# Altium schematic sheet ARM+SERVO+I O.SchDoc
size A
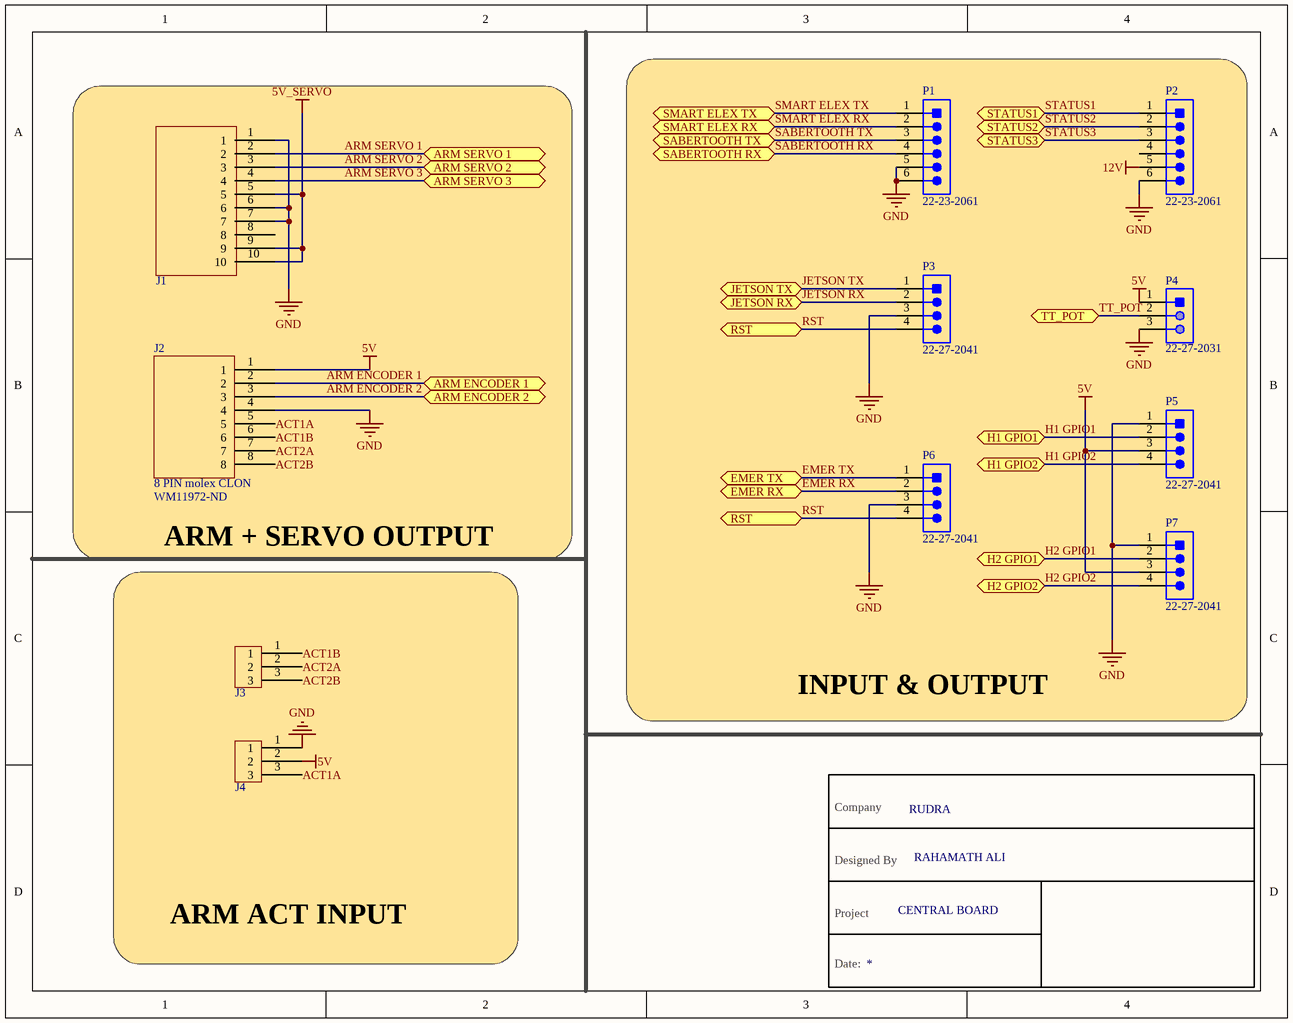
[diagram p0: ARM+SERVO+I O.SchDoc]

## Parts
?  Project: CENTRAL BOARD  Designed By: RAHAMATH ALI  Company: RUDRA  (hidden comment: Schematic Table)  (graphical)
J1  10 PIN MOLEX CLON  [10 pin molex]  (value not drawn)
J2  8 PIN molex CLON  Supplier Part Number 1: WM11972-ND  [8 PIN MOLEX CLON]
J3  3 PIN GREEN  [PHOENIX_MSTBA_2,5_3-G-5,08_1757255]  (value not drawn)
J4  3 PIN GREEN  [PHOENIX_MSTBA_2,5_3-G-5,08_1757255]  (value not drawn)
P1  22-23-2061  [MOLX-22-23-2061_V]
P2  22-23-2061  [MOLX-22-23-2061_V]
P3  22-27-2041  [MOLX-22-27-2041_V]
P4  22-27-2031  [MOLX-22-27-2031_V]
P5  22-27-2041  [MOLX-22-27-2041_V]
P6  22-27-2041  [MOLX-22-27-2041_V]
P7  22-27-2041  [MOLX-22-27-2041_V]

## Blocks framed on the sheet
INPUT & OUTPUT: P1-P7
ARM + SERVO OUTPUT: J1 J2
ARM ACT INPUT: J3 J4

## Ports
ARM ENCODER 1 (bidir), ARM ENCODER 2 (bidir), ARM SERVO 1 (bidir), ARM SERVO 2 (bidir), ARM SERVO 3 (bidir), EMER RX (bidir), EMER TX (bidir), H1 GPIO1 (bidir), H1 GPIO2 (bidir), H2 GPIO1 (bidir), H2 GPIO2 (bidir), JETSON RX (bidir), JETSON TX (bidir), RST (bidir), SABERTOOTH RX (bidir), SABERTOOTH TX (bidir), SMART ELEX RX (bidir), SMART ELEX TX (bidir), STATUS1 (bidir), STATUS2 (bidir), STATUS3 (bidir), TT_POT (bidir)

## Nets
5V: J2.1 J4.2 P4.1 P5.3 P7.3
5V_SERVO: J1.5 J1.9 J1.10
12V: P2.5
GND: J1.1 J1.6 J1.7 J2.4 J4.1 P1.5 P1.6 P2.6 P3.3 P4.3 P5.1 P6.3 P7.1
ACT1A: J2.5 J4.3
ACT1B: J2.6 J3.1
ACT2A: J2.7 J3.2
ACT2B: J2.8 J3.3
ARM ENCODER 1: J2.2 ; port ARM ENCODER 1
ARM ENCODER 2: J2.3 ; port ARM ENCODER 2
ARM SERVO 1: J1.2 ; port ARM SERVO 1
ARM SERVO 2: J1.3 ; port ARM SERVO 2
ARM SERVO 3: J1.4 ; port ARM SERVO 3
EMER RX: P6.2 ; port EMER RX
EMER TX: P6.1 ; port EMER TX
H1 GPIO1: P5.2 ; port H1 GPIO1
H1 GPIO2: P5.4 ; port H1 GPIO2
H2 GPIO1: P7.2 ; port H2 GPIO1
H2 GPIO2: P7.4 ; port H2 GPIO2
JETSON RX: P3.2 ; port JETSON RX
JETSON TX: P3.1 ; port JETSON TX
RST: P3.4 P6.4 ; port RST
SABERTOOTH RX: P1.4 ; port SABERTOOTH RX
SABERTOOTH TX: P1.3 ; port SABERTOOTH TX
SMART ELEX RX: P1.2 ; port SMART ELEX RX
SMART ELEX TX: P1.1 ; port SMART ELEX TX
STATUS1: P2.1 ; port STATUS1
STATUS2: P2.2 ; port STATUS2
STATUS3: P2.3 ; port STATUS3
TT_POT: P4.2 ; port TT_POT

Not connected (* = marked no-connect by the designer): J1 8; P2 4

## Notes on the sheet
- (in symbol Schematic Table) Company; Designed By; Project; Date:

## Library data of the parts
J2 = 8 PIN molex CLON: Manufacturer Part Number 1: 76825-0008; Number of Circuits: 8; Gender: Male; Pitch: 5.7mm; Supplier 1: Digi-Key; Manufacturer 1: Molex; Stock 1: 794; Pricing 1: 1=2.83000, 10=2.72000, 25=2.49360, 50=2.38040, 100=2.26700, 250=1.98364, 672=1.92695, 1344=1.64357, 2688=1.53022 (USD); RoHS: Yes; Mount: Through Hole; Number of Pins: 8; Color: Black; Contact Plating: Tin; Contact Material: Copper; Termination: Through Hole; Number of Rows: 2; Orientation: Right Angle; Number of Contacts: 8; REACH SVHC: Unknown; ComponentLink1URL: http://www.alliedelec.com/images/products/datasheets/bm/BrandonData/70717241.pdf?src-supplier=Allied+Electronics; ComponentLink1Description: http://www.alliedelec.com/images/products/datasheets/bm/BrandonData/70717241.pdf?src-supplier=Allied+Electronics; ComponentLink2URL: http://www.farnell.com/datasheets/2216656.pdf?src-supplier=Farnell; ComponentLink2Description: http://www.farnell.com/datasheets/2216656.pdf?src-supplier=Farnell; ComponentLink3URL: http://www.farnell.com/datasheets/1968956.pdf?src-supplier=Element14; ComponentLink3Description: http://www.farnell.com/datasheets/1968956.pdf?src-supplier=Element14; ComponentLink4URL: http://www.farnell.com/datasheets/2001779.pdf?src-supplier=Element14; ComponentLink4Description: http://www.farnell.com/datasheets/2001779.pdf?src-supplier=Element14; ComponentLink5URL: http://www.farnell.com/datasheets/2216656.pdf?src-supplier=Newark; ComponentLink5Description: http://www.farnell.com/datasheets/2216656.pdf?src-supplier=Newark; ComponentLink6URL: https://www.molex.com/pdm_docs/sd/768250008_sd.pdf?src-supplier=Digi-Key; ComponentLink6Description: https://www.molex.com/pdm_docs/sd/768250008_sd.pdf?src-supplier=Digi-Key
J3 J4 = 3 PIN GREEN: Manufacturer 1: Phoenix Contact; Manufacturer Part Number 1: 1757255; Current Rating: 12A; Voltage Rating: 250V; Voltage Rating (DC): 320V; Number of Poles: 3; Number of Levels: 1; Current: 15A; Voltage: 300V; Connector Type: Plug; Gender: Male; Pitch: 5.08mm; Approvals: UL,CSA,VDE,EN; Supplier 1: Digi-Key; Stock 1: 4025; Pricing 1: 1=1.03000, 10=0.99000, 50=0.94720, 100=0.92130, 250=0.86100, 500=0.79212, 1000=0.73185, 2500=0.69741, 5000=0.65436 (USD); RoHS: Yes; Mount: Through Hole; Weight: 5.396916oz; Color: Grey,Green; Contact Plating: Tin; Housing Color: Green; Housing Material: Polybutylene; Contact Material: Tin; Package Quantity: 50; Packaging: Bulk; Termination: Solder; Max Current Rating: 12A; Number of Rows: 1; Number of Positions: 3; Number of Positions Per Level: 3; Number of Contacts: 3; Orientation: Right Angle; Length: 17.24mm; Height: 12.1mm; Depth: 12mm; Width: 17.16mm; Lead Free: Lead Free; Flammability Rating: UL94 V-0; REACH SVHC: No SVHC; ComponentLink1URL: https://datasheet.ciiva.com/15197/getdatasheetpartid-176351-15197329.pdf?src-supplier=Verical; ComponentLink1Description: https://datasheet.ciiva.com/15197/getdatasheetpartid-176351-15197329.pdf?src-supplier=Verical; ComponentLink2URL: https://datasheet.ciiva.com/16096/1757255-16096404.pdf?src-supplier=Onlinecomponents.com; ComponentLink2Description: https://datasheet.ciiva.com/16096/1757255-16096404.pdf?src-supplier=Onlinecomponents.com; ComponentLink3URL: https://datasheet.ciiva.com/7630/1697152-7630840.pdf?src-supplier=Element14; ComponentLink3Description: https://datasheet.ciiva.com/7630/1697152-7630840.pdf?src-supplier=Element14; ComponentLink4URL: https://datasheet.ciiva.com/795/1757255-795421.pdf?src-supplier=Digi-Key; ComponentLink4Description: https://datasheet.ciiva.com/795/1757255-795421.pdf?src-supplier=Digi-Key; ComponentLink5URL: https://datasheet.ciiva.com/29210/569707-da-01-en-grundgehaeuse-1757255-250-st-29210878.pdf?src-supplier=Conrad; ComponentLink5Description: https://datasheet.ciiva.com/29210/569707-da-01-en-grundgehaeuse-1757255-250-st-29210878.pdf?src-supplier=Conrad; Supplier Part Number 1: 277-1107-ND
P1 P2 = CMP-2000-05536-1: Male Header, Pitch 2.54 mm, 1 x 6 Position, Height 10.67 mm, Tail Length 3.56 mm, 0 to 70 degC, RoHS, Bulk; Manufacturer: Molex; Pitch: 2.54mm; Mounting Angle: Vertical; Current Rating: 4A; Number of Positions / Contacts: 6; Voltage Rating: 250V; Packaging: Bulk; Package Description: Male Header, Pitch 2.54 mm, 1 x 6 Position, Height 10.67 mm, Tail Length 3.56 mm; Number of Rows: 1; Type: PinStrip; Contact Material: Brass; Product Category: .100K.K.Connectors; Factory Pack Quantity: 1000; Mounting Style: ThroughHole; RoHS: Details; Contact Plating: Tin; Housing Material: Nylon; Mounting Technology: ThroughHole; Termination Style: ThroughHole; Tradename: KK; Number of Positions: 6; Brand: Molex; Product Type: Headers; Series: 6373; Datasheet URL: https://datasheet.ciiva.com/19460/232303-19460895.pdf; Package Reference: 22-23-2061; Datasheet Version: Rev. P, 09/2001; Manufacturer URL: http://www.molex.com/
P3 P5-P7 = CMP-2000-05243-1: Male Header, Pitch 2.54 mm, 1 x 4 Position, Height 11.7 mm, Tail Length 3.56 mm, RoHS, Bulk; Manufacturer: Molex; Voltage rating: 250V; Current rating: 4A; Datasheet Version: Rev. F, 06/2009; Operating temperature: 0degCto+75degC; Contact material: Tinplatedbrass; Manufacturer URL: http://www.molex.com/; Housing material: Nylon(UL94V-0); Datasheet URL: http://www.molex.com/pdm_docs/sd/022272041_sd.pdf
P4 = CMP-2000-05538-1: Male Header, Pitch 2.54 mm, 1 x 3 Position, Height 11.7 mm, Tail Length 3.56 mm, -40 to 80 degC, RoHS, Bulk; Manufacturer: Molex; Voltage rating: 250V; Current rating: 4A; Package Reference: 22-27-2031; Housing material: Nylon(UL94V-0); Operating temperature: 0°Cto+75°C; Package Description: Male Header, Pitch 2.54 mm, 1 x 3 Position, Height 11.7 mm, Tail Length 3.56 mm; Package URL: http://www.molex.com/pdm_docs/sd/022272031_sd.pdf; Datasheet Version: 06/2016; Manufacturer URL: http://www.molex.com/; Mounting Technology: ThroughHole; Datasheet URL: http://www.molex.com/webdocs/datasheets/pdf/en-us/0022272031_PCB_HEADERS.pdf; Contact material: Tinplatedbrass